# EAGLE design batBeep (EAGLE 5.12)
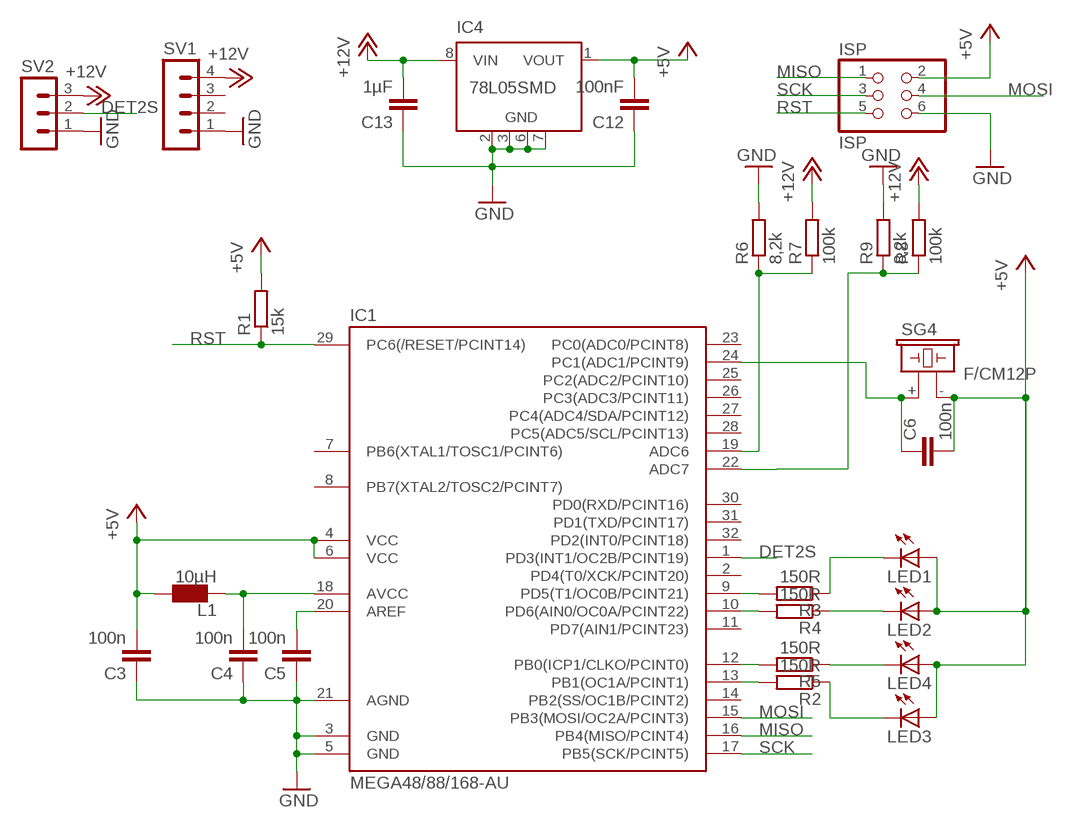
[diagram p0: schematic, sheet 1]

## Parts
C3  100n  C-EUC0402  [C0402]
C4  100n  C-EUC0402  [C0402]
C5  100n  C-EUC0402  [C0402]
C6  100n  C-EUC0402  [C0402]
C12  100nF  CAP0402-CAP  [0402-CAP]
C13  1µF  CAP0805  [0805]
IC1  MEGA48/88/168-AU  [TQFP32-08]
IC4  78L05SMD  [SO08]
ISP  ISP  PINHD-2X03_2.54  [2X03]
L1  10µH  L0805  [0805]
LED1  LEDCHIPLED_0805  [CHIPLED_0805]
LED2  LEDCHIPLED_0805  [CHIPLED_0805]
LED3  LEDCHIPLED_0805  [CHIPLED_0805]
LED4  LEDCHIPLED_0805  [CHIPLED_0805]
R1  15k  R-EU_R0402  [R0402]
R2  150R  R-EU_R0402  [R0402]
R3  150R  R-EU_R0402  [R0402]
R4  150R  R-EU_R0402  [R0402]
R5  150R  R-EU_R0402  [R0402]
R6  8,2k  R-EU_R0402  [R0402]
R7  100k  R-EU_R0402  [R0402]
R8  100k  R-EU_R0402  [R0402]
R9  8,2k  R-EU_R0402  [R0402]
SG4  F/CM12P  [F/CM12P]
SV1  MA04-1  [MA04-1]
SV2  MA03-1  [MA03-1]

## Nets
+5V: C3.2 C6.2 C12.2 IC1.4(VCC) IC1.6(VCC) IC4.1(VOUT) ISP.2 L1.1 LED1.A LED2.A LED3.A LED4.A R1.2 SG4.-
+12V: C13.2 IC4.8(VIN) R7.2 R8.2 SV1.4 SV2.3
AREF: C5.2 IC1.20(AREF)
AVCC: C4.2 IC1.18(AVCC) L1.2
DET2S: IC1.1(PD3(INT1/OC2B/PCINT19)) SV2.2
GND: C3.1 C4.1 C5.1 C12.1 C13.1 IC1.3(GND) IC1.5(GND) IC1.21(AGND) IC4.2(GND) IC4.3(GND) IC4.6(GND) IC4.7(GND) ISP.6 R6.2 R9.2 SV1.1 SV2.1
MISO: IC1.16(PB4(MISO/PCINT4)) ISP.1
MOSI: IC1.15(PB3(MOSI/OC2A/PCINT3)) ISP.4
N$1: C6.1 IC1.24(PC1(ADC1/PCINT9)) SG4.+
N$2: IC1.9(PD5(T1/OC0B/PCINT21)) R3.2
N$3: IC1.10(PD6(AIN0/OC0A/PCINT22)) R4.2
N$4: IC1.22(ADC7) R8.1 R9.1
N$6: IC1.12(PB0(ICP1/CLKO/PCINT0)) R5.2
N$7: IC1.13(PB1(OC1A/PCINT1)) R2.2
N$8: LED3.C R2.1
N$9: LED4.C R5.1
N$13: LED1.C R3.1
N$14: LED2.C R4.1
N$16: IC1.19(ADC6) R6.1 R7.1
RST: IC1.29(PC6(/RESET/PCINT14)) ISP.5 R1.1
SCK: IC1.17(PB5(SCK/PCINT5)) ISP.3
Unconnected: IC1.2(PD4(T0/XCK/PCINT20)) IC1.7(PB6(XTAL1/TOSC1/PCINT6)) IC1.8(PB7(XTAL2/TOSC2/PCINT7)) IC1.11(PD7(AIN1/PCINT23)) IC1.14(PB2(SS/OC1B/PCINT2)) IC1.23(PC0(ADC0/PCINT8)) IC1.25(PC2(ADC2/PCINT10)) IC1.26(PC3(ADC3/PCINT11)) IC1.27(PC4(ADC4/SDA/PCINT12)) IC1.28(PC5(ADC5/SCL/PCINT13)) IC1.30(PD0(RXD/PCINT16)) IC1.31(PD1(TXD/PCINT17)) IC1.32(PD2(INT0/PCINT18)) IC4.4(NC) IC4.5(NC) SV1.2 SV1.3

## Library data of the parts
C3-C6 = rcl:C-EU: CAPACITOR, European symbol
C12 C13 = SparkFun:CAP: Capacitor Standard 0603 ceramic capacitor, and 0.1" leaded capacitor.
IC1 = avr-7:MEGA48/88/168
IC4 = linear:78L*SMD: Positive VOLTAGE REGULATOR
ISP = pinhead-2:PINHD-2X03: PIN HEADER
L1 = seb:L0805
LED1-LED4 = led:LED: LED OSRAM: - CHIPLED LG R971, LG N971, LY N971, LG Q971, LY Q971, LO R971, LY R971 LH N974, LH R974 LS Q976, LO Q976, LY Q976 LO Q996 - Hyper CHIPLED LW Q18S LB Q993, LB Q99A, LB R99A - SideLED LS A670, LO A670, LY A670, LG A670, LP A670 LB A673, LV A673, LT A673, LW A673 LH A674 LY A675 LS A676, LA A676, LO A676, LY A676, LW A676 LS A679, LY A679, LG A679 - Hyper Micro SIDELED® LS Y876, LA Y876, LO Y876, LY Y876 LT Y87S - SmartLED LW L88C, LW L88S LB L89C, LB L89S, LG L890 LS L89K, LO L89K, LY L89K LS L896, LA L896, LO L896, LY L896 - TOPLED LS T670, LO T670, LY T670, LG T670, LP T670 LSG T670, LSP T670, LSY T670, LOP T670, LYG T670 LG T671, LOG T671, LSG T671 LB T673, LV T673, LT T673, LW T673 LH T674 LS T676, LA T676, LO T676, LY T676, LB T676, LH T676, LSB T676, LW T676 LB T67C, LV T67C, LT T67C, LS T67K, LO T67K, LY T67K, LW E67C LS E67B, LA E67B, LO E67B, LY E67B, LB E67C, LV E67C, LT E67C LW T67C LS T679, LY T679, LG T679 LS T770, LO T770, LY T770, LG T770, LP T770 LB T773, LV T773, LT T773, LW T773 LH T774 LS E675, LA E675, LY E675, LS T675 LS T776, LA T776, LO T776, LY T776, LB T776 LHGB T686 LT T68C, LB T68C - Hyper Mini TOPLED® LB M676 - Mini TOPLED Santana® LG M470 LS M47K, LO M47K, LY M47K Source: http://www.osram.convergy.de LUXEON: - LUMILED® LXK2-PW12-R00, LXK2-PW12-S00, LXK2-PW14-U00, LXK2-PW14-V00 LXK2-PM12-R00, LXK2-PM12-S00, LXK2-PM14-U00 LXK2-PE12-Q00, LXK2-PE12-R00, LXK2-PE12-S00, LXK2-PE14-T00, LXK2-PE14-U00 LXK2-PB12-K00, LXK2-PB12-L00, LXK2-PB12-M00, LXK2-PB14-N00, LXK2-PB14-P00, LXK2-PB14-Q00 LXK2-PR12-L00, LXK2-PR12-M00, LXK2-PR14-Q00, LXK2-PR14-R00 LXK2-PD12-Q00, LXK2-PD12-R00, LXK2-PD12-S00 LXK2-PH12-R00, LXK2-PH12-S00 LXK2-PL12-P00, LXK2-PL12-Q00, LXK2-PL12-R00 Source: www.luxeon.com KINGBRIGHT: KA-3528ASYC Source: www.kingbright.com
R1-R9 = rcl:R-EU_: RESISTOR, European symbol
SG4 = buzzer:F/CM12P: BUZZER Source: Buerklin; OC_FARNELL: unknown; OC_NEWARK: unknown
SV1 = con-lstb:MA04-1: PIN HEADER; OC_FARNELL: unknown; OC_NEWARK: unknown
SV2 = con-lstb:MA03-1: PIN HEADER; OC_FARNELL: unknown; OC_NEWARK: unknown

## Board
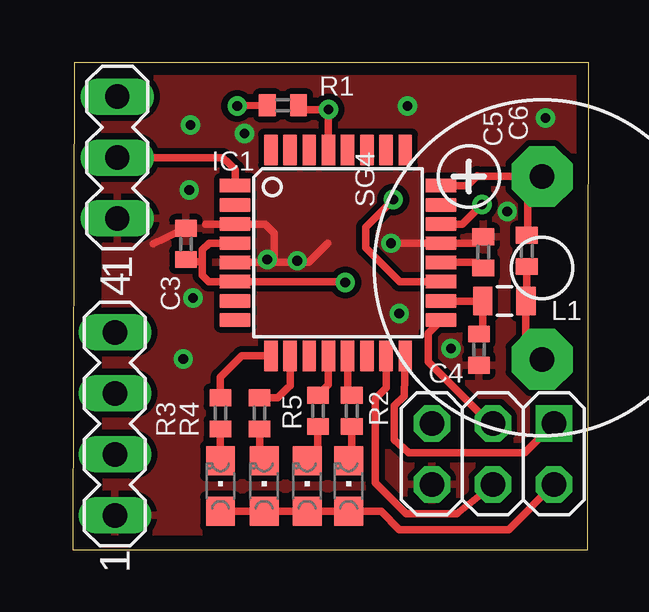
[diagram p1: board, top side]
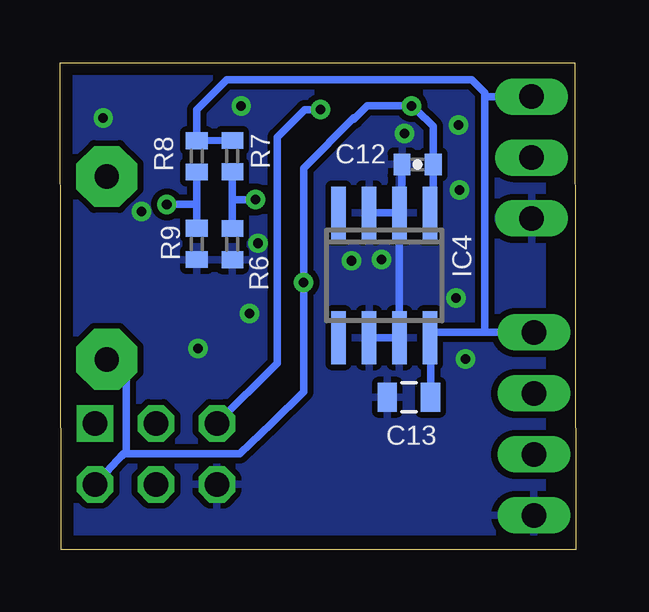
[diagram p2: board, bottom side, seen from below]

Size 21.5 x 20.3 mm. Coordinates in mm from the lower left corner, seen from the top.
Outline: 0,0 21.45,0 21.5,20.3 0.05,20.3 0,0
Copper layers (1*16): Top 0.035mm / dielectric 1.5mm / Bottom 0.035mm
Design rules "default *": minimum track width 10mil, minimum drill 24mil, track to track 8mil, track to pad 8mil, pad to pad 8mil, via to via 8mil, smd to smd 8mil, copper to edge 20mil, drill to drill 8mil, minimum pad ring 10mil, minimum via ring 8mil, stop-mask expansion 4mil, vias tented up to drill 30mil, thermal gap 10mil

### Footprints (pad centres in the part's own frame; a part is rotated, then mirrored left to right if it is on the bottom)
C0402 = smd 0.7 x 0.9: 1 -0.65,0; 2 0.65,0
0402-CAP = smd 0.7 x 0.9: 1 -0.65,0; 2 0.65,0
0805 = smd 0.8 x 1.2: 1 -0.9,0; 2 0.9,0
TQFP32-08 = smd 1.27 x 0.559: 1 -4.293,2.8; 2 -4.293,2; 3 -4.293,1.2; 4 -4.293,0.4; 5 -4.293,-0.4; 6 -4.293,-1.2; 7 -4.293,-2; 8 -4.293,-2.8; 17 4.293,-2.8; 18 4.293,-2; 19 4.293,-1.2; 20 4.293,-0.4; 21 4.293,0.4; 22 4.293,1.2; 23 4.293,2; 24 4.293,2.8 | smd 0.559 x 1.27: 9 -2.8,-4.293; 10 -2,-4.293; 11 -1.2,-4.293; 12 -0.4,-4.293; 13 0.4,-4.293; 14 1.2,-4.293; 15 2,-4.293; 16 2.8,-4.293; 25 2.8,4.293; 26 2,4.293; 27 1.2,4.293; 28 0.4,4.293; 29 -0.4,4.293; 30 -1.2,4.293; 31 -2,4.293; 32 -2.8,4.293
SO08 = smd 0.6 x 2.2: 1 -1.905,-2.6; 2 -0.635,-2.6; 3 0.635,-2.6; 4 1.905,-2.6; 5 1.905,2.6; 6 0.635,2.6; 7 -0.635,2.6; 8 -1.905,2.6
2X03 = drill 1.016 square: 1 -2.54,-1.27 | drill 1.016 octagon: 2 -2.54,1.27; 3 0,-1.27; 4 0,1.27; 5 2.54,-1.27; 6 2.54,1.27
CHIPLED_0805 = smd 1.2 x 1.2: A 0,-1.05; C 0,1.05
R0402 = smd 0.7 x 0.9: 1 -0.65,0; 2 0.65,0
F/CM12P = drill 1.016 pad 2.54 octagon: + 3.81,0; - -3.81,0
MA04-1 = drill 1.016 long: 1 -3.81,0; 2 -1.27,0; 3 1.27,0; 4 3.81,0
MA03-1 = drill 1.016 long: 1 -2.54,0; 2 0,0; 3 2.54,0

### Placement (x,y rotation side)
C3  4.71,12.75 270 top
C4  16.92,8.35 90 top
C5  17.1,12.4 270 top
C6  18.91,12.46 270 top
C12  6.6,16.06 0 bottom
C13  6.96,6.36 0 bottom
IC1  11.05,12.38 0 top
IC4  7.99,11.44 180 bottom
ISP  17.5,4 180 top
L1  17.98,10.37 180 top
LED1  6.15,2.66 0 top
LED2  7.97,2.66 0 top
LED3  11.49,2.66 0 top
LED4  9.76,2.66 0 top
R1  8.75,18.53 180 top
R2  11.62,5.79 90 top
R3  6.15,5.69 90 top
R4  7.78,5.69 90 top
R5  10.21,5.79 90 top
R6  14.32,12.74 270 bottom
R7  14.32,16.41 90 bottom
R8  15.8,16.4 90 bottom
R9  15.8,12.75 270 bottom
SG4  19.55,11.75 90 top
SV1  1.75,5.25 90 top
SV2  1.85,16.35 90 top

### Tracks (layer width: path | path; a pad name or v marks a point on that pad's centre or on a via)
+5V  (via drill 0.4)
  Top 0.305: 5.4,12 5.4,11.45 5.67,11.18 IC1.6 11.32,11.18 v11.35,11.15 | 5.4,12 5.4,12.5 5.68,12.78 IC1.4 | C3.2 4.66,12 5.4,12 | v6.85,18.5 R1.2 | LED1.A LED2.A LED4.A LED3.A 12.84,1.61 13.6,0.85 18.16,0.85 ISP.2 | SG4.- 18.88,7.94 18.88,8.61 L1.1 18.91,10.4 C6.2
  Bottom 0.305: 18.75,4 14,4 12.68,5.27 11.35,6.6 v11.35,11.15 11.35,15.9 9.25,18 9.25,17.95 8.7,18.5 v6.85,18.5 6.65,18.35 5.95,17.65 C12.2 5.95,14.17 IC4.1 | ISP.2 18.87,4 | 18.87,4 18.9,3.92 | 18.87,4 18.75,4 | 18.75,4 18.75,7.14 18.75,7.94 SG4.-
+12V
  Bottom 0.305: C13.2 6.06,8.81 IC4.8 5.86,9.06 3.75,9.06 | 3.8,19 3.8,9.71 3.8,9.11 3.75,9.06 | 3.8,19 3.8,19.05 4.35,19.6 14.55,19.6 15.7,18.45 15.8,18.35 R8.2 15.69,17.05 R7.2 | SV2.3 3.69,18.89 3.8,19 | SV1.4 3.75,9.06
AREF
  Top 0.305: IC1.20 16.87,11.98 C5.2
AVCC
  Top 0.305: IC1.18 15.35,10.37 L1.2 17.08,9.01 C4.2
DET2S
  Top 0.305: IC1.1 6.76,15.84 6.45,16.15 6.25,16.35 SV2.2
GND  (via drill 0.4)
  Top 0.305: IC1.5 8.4,11.98 | 8.4,11.98 9.83,11.98 10.63,12.78 | v13.25,12.78 IC1.21 16.83,12.78 C5.1 | 8.4,11.98 8.4,13.2 8.02,13.58 IC1.3 5.53,13.58 | 3.35,12.75 C3.1
  Bottom 0.305: IC4.2 IC4.3 | IC4.6 IC4.7 IC4.2 | IC4.2 7.25,14.14 C12.1
  other vias: 15.75,8.4 9.35,12.05 8.1,12.1 7.15,17.35 13.6,9.85 18.1,14.1 5,10.5 4.85,15 4.9,17.7 13.95,18.5 19.7,18 4.6,7.95
  pour Bottom (isolate 0.254): 1.4,0.75 21.4,0.75 21.4,20.2 1.4,20.2
  pour Top (isolate 0.254): 1.4,0.75 21.4,0.75 21.3,20.2 1.3,20.2
MISO
  Top 0.305: ISP.1 18.82,4.05 14,4.05 13.4,4.6 13.4,6 13.8,6.4 IC1.16
MOSI
  Top 0.305: IC1.15 13.05,6.75 12.6,6.3 12.6,2.8 13.9,1.5 16,1.5 17.28,2.53 ISP.4
N$1
  Top 0.305: C6.1 18.95,13.15 18.95,14.96 SG4.+ 16.89,15.56 16.85,15.6 16.43,15.18 IC1.24
N$2
  Top 0.305: R3.2 6.15,7.2 6.85,7.9 7.04,8.09 IC1.9
N$3
  Top 0.305: R4.2 8.54,6.34 8.95,6.75 9.05,6.85 IC1.10
N$4  (via drill 0.4)
  Top 0.305: v17.05,14.4 16.45,13.8 16.23,13.58 IC1.22
  Bottom 0.305: R8.1 R9.1 15.8,14.4 v17.05,14.4
N$6
  Top 0.305: R5.2 10.65,6.88 IC1.12
N$7
  Top 0.305: R2.2 11.45,6.61 IC1.13
N$8
  Top 0.305: LED3.C 11.62,3.84 R2.1
N$9
  Top 0.305: LED4.C 10.21,4.16 R5.1
N$13
  Top 0.305: R3.1 LED1.C
N$14
  Top 0.305: LED2.C 7.78,3.9 R4.1
N$16  (via drill 0.4)
  Top 0.305: IC1.19 13.62,11.18 12.2,12.6 12.2,13.45 v13.35,14.6
  Bottom 0.305: v13.35,14.6 13.9,14.6 14.27,14.6 14.32,14.55 | 14.32,14.55 R6.1 | 14.32,14.55 R7.1
RST  (via drill 0.4)
  Top 0.305: IC1.29 v10.65,18.35 9.58,18.35 R1.1
  Bottom 0.305: ISP.5 12.45,7.78 12.45,17.2 11.3,18.35 v10.65,18.35
SCK
  Top 0.305: ISP.3 17.33,5.32 14.8,7.85 14.8,9.04 IC1.17